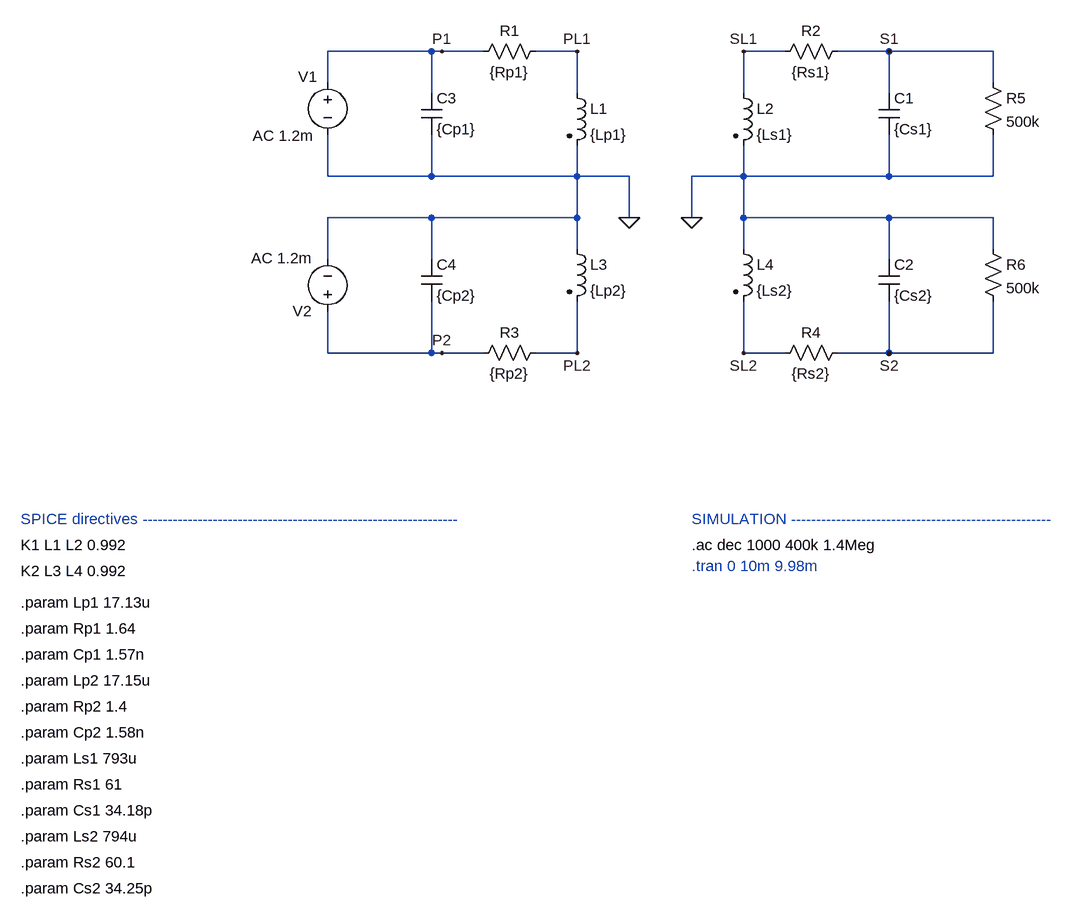
[diagram p0: schematic 1-half_bps_p.asc]
1-half_bps_p.asc, the LTspice schematic file:
Version 4
SHEET 1 1868 1404
WIRE -32 32 -192 32
WIRE -16 32 -32 32
WIRE 48 32 -16 32
WIRE 192 32 128 32
WIRE 512 32 448 32
WIRE 672 32 592 32
WIRE 832 32 672 32
WIRE -192 80 -192 32
WIRE 832 80 832 32
WIRE -32 96 -32 32
WIRE 192 96 192 32
WIRE 448 96 448 32
WIRE 672 96 672 32
WIRE -192 224 -192 160
WIRE -32 224 -32 160
WIRE -32 224 -192 224
WIRE 192 224 192 176
WIRE 192 224 -32 224
WIRE 272 224 192 224
WIRE 448 224 448 176
WIRE 448 224 368 224
WIRE 672 224 672 160
WIRE 672 224 448 224
WIRE 832 224 832 160
WIRE 832 224 672 224
WIRE -32 288 -192 288
WIRE 192 288 192 224
WIRE 192 288 -32 288
WIRE 272 288 272 224
WIRE 368 288 368 224
WIRE 448 288 448 224
WIRE 672 288 448 288
WIRE 832 288 672 288
WIRE 192 336 192 288
WIRE 448 336 448 288
WIRE 832 336 832 288
WIRE -192 352 -192 288
WIRE -32 352 -32 288
WIRE 672 352 672 288
WIRE -192 496 -192 432
WIRE -32 496 -32 416
WIRE -32 496 -192 496
WIRE -16 496 -32 496
WIRE 48 496 -16 496
WIRE 192 496 192 416
WIRE 192 496 128 496
WIRE 448 496 448 416
WIRE 512 496 448 496
WIRE 672 496 672 416
WIRE 672 496 592 496
WIRE 832 496 832 416
WIRE 832 496 672 496
FLAG 192 32 PL1
FLAG 448 32 SL1
FLAG 672 32 S1
FLAG -16 32 P1
FLAG 192 496 PL2
FLAG 448 496 SL2
FLAG 672 496 S2
FLAG -16 496 P2
FLAG 272 288 0
FLAG 368 288 0
SYMBOL ind2 176 80 R0
SYMATTR InstName L1
SYMATTR Value {Lp1}
SYMATTR Type ind
SYMBOL ind2 432 80 R0
SYMATTR InstName L2
SYMATTR Value {Ls1}
SYMATTR Type ind
SYMBOL res 144 16 R90
WINDOW 0 0 56 VBottom 2
WINDOW 3 32 56 VTop 2
SYMATTR InstName R1
SYMATTR Value {Rp1}
SYMBOL res 608 16 R90
WINDOW 0 0 56 VBottom 2
WINDOW 3 32 56 VTop 2
SYMATTR InstName R2
SYMATTR Value {Rs1}
SYMBOL cap 656 96 R0
SYMATTR InstName C1
SYMATTR Value {Cs1}
SYMBOL voltage -192 64 R0
WINDOW 123 -115 98 Left 2
WINDOW 39 0 0 Left 0
WINDOW 0 -45 7 Left 2
SYMATTR Value2 AC 1.2m
SYMATTR InstName V1
SYMATTR Value ""
SYMBOL ind2 176 320 R0
SYMATTR InstName L3
SYMATTR Value {Lp2}
SYMATTR Type ind
SYMBOL ind2 432 320 R0
SYMATTR InstName L4
SYMATTR Value {Ls2}
SYMATTR Type ind
SYMBOL voltage -192 448 R180
WINDOW 123 24 98 Left 2
WINDOW 39 0 0 Left 0
SYMATTR Value2 AC 1.2m
SYMATTR InstName V2
SYMATTR Value ""
SYMBOL res 144 480 R90
WINDOW 0 0 56 VBottom 2
WINDOW 3 32 56 VTop 2
SYMATTR InstName R3
SYMATTR Value {Rp2}
SYMBOL res 608 480 R90
WINDOW 0 0 56 VBottom 2
WINDOW 3 32 56 VTop 2
SYMATTR InstName R4
SYMATTR Value {Rs2}
SYMBOL cap 656 352 R0
SYMATTR InstName C2
SYMATTR Value {Cs2}
SYMBOL res 816 64 R0
SYMATTR InstName R5
SYMATTR Value 500k
SYMBOL res 816 320 R0
SYMATTR InstName R6
SYMATTR Value 500k
SYMBOL cap -48 96 R0
SYMATTR InstName C3
SYMATTR Value {Cp1}
SYMBOL cap -48 352 R0
SYMATTR InstName C4
SYMATTR Value {Cp2}
TEXT -664 752 Left 2 ;SPICE directives ---------------------------------------------------------------
TEXT 368 792 Left 2 !.ac dec 1000 400k 1.4Meg
TEXT 368 752 Left 2 ;SIMULATION ----------------------------------------------------
TEXT 368 824 Left 2 ;.tran 0 10m 9.98m
TEXT -664 792 Left 2 !K1 L1 L2 0.992
TEXT -664 880 Left 2 !.param Lp1 17.13u
TEXT -664 960 Left 2 !.param Cp1 1.57n
TEXT -664 920 Left 2 !.param Rp1 1.64
TEXT -664 1000 Left 2 !.param Lp2 17.15u
TEXT -664 1080 Left 2 !.param Cp2 1.58n
TEXT -664 1040 Left 2 !.param Rp2 1.4
TEXT -664 1120 Left 2 !.param Ls1 793u
TEXT -664 1200 Left 2 !.param Cs1 34.18p
TEXT -664 1160 Left 2 !.param Rs1 61
TEXT -664 1240 Left 2 !.param Ls2 794u
TEXT -664 1320 Left 2 !.param Cs2 34.25p
TEXT -664 1280 Left 2 !.param Rs2 60.1
TEXT -664 832 Left 2 !K2 L3 L4 0.992

The netlist it stands for:
* 1-half_bps_p.asc
L1 PL1 0 {Lp1}
L2 SL1 0 {Ls1}
R1 PL1 P1 {Rp1}
R2 S1 SL1 {Rs1}
C1 S1 0 {Cs1}
V1 P1 0 AC 1.2m
L3 0 PL2 {Lp2}
L4 0 SL2 {Ls2}
V2 P2 0 AC 1.2m
R3 PL2 P2 {Rp2}
R4 S2 SL2 {Rs2}
C2 0 S2 {Cs2}
R5 S1 0 500k
R6 0 S2 500k
C3 P1 0 {Cp1}
C4 0 P2 {Cp2}
* SPICE directives ---------------------------------------------------------------
.ac dec 1000 400k 1.4Meg
* SIMULATION ----------------------------------------------------
* .tran 0 10m 9.98m
K1 L1 L2 0.992
.param Lp1 17.13u
.param Cp1 1.57n
.param Rp1 1.64
.param Lp2 17.15u
.param Cp2 1.58n
.param Rp2 1.4
.param Ls1 793u
.param Cs1 34.18p
.param Rs1 61
.param Ls2 794u
.param Cs2 34.25p
.param Rs2 60.1
K2 L3 L4 0.992
.backanno
.end